# EasyEDA Pro project ProProject_Mini-Cube_2024-04-10.epro, board PCB1
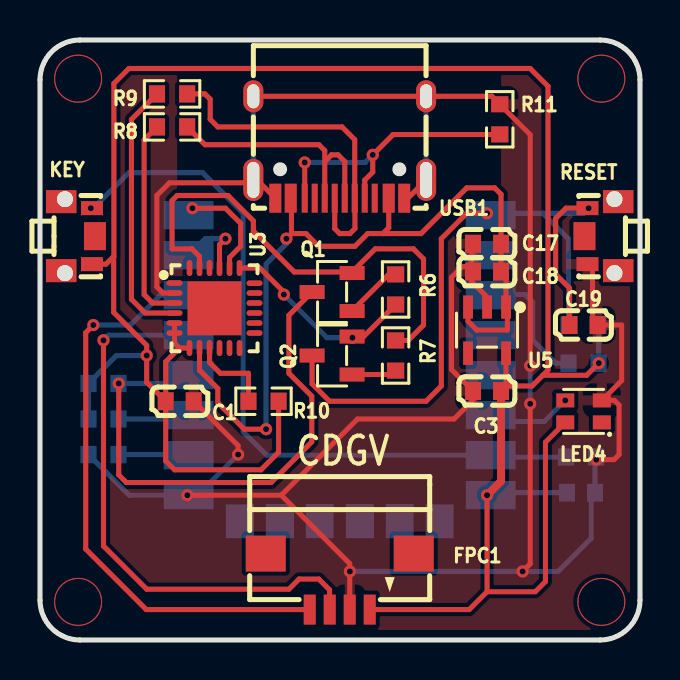
[diagram p5: board, top side]
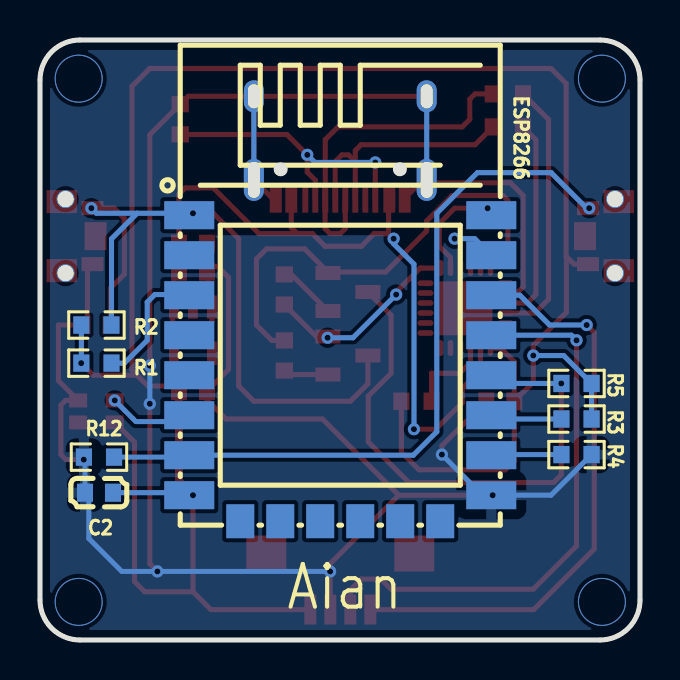
[diagram p6: board, bottom side, seen from below]

Outline 30 x 30 mm; copper layers: Top Layer, Bottom Layer. Coordinates in mm from the lower left corner of the outline.
Outline path: 0,28 0,2 arc(0.59,0.59) 2,0 28,0 arc(29.41,0.59) 30,2 30,28 arc(29.41,29.41) 28,30 2,30 arc(0.59,29.41) 0,28
Stack: Top Layer 0.035mm / Dielectric1 1.51mm FR4 er 4.5 / Bottom Layer 0.035mm

## Design rules (mm)
template: JLCPCB Capability(Two Layers Board)
spacing copperThickness1oz (default): track to track 0.102, other pairs 0.152 to 0.3
spacing copperThickness2oz: track to track 0.203, other pairs 0.152 to 0.3
track width copperThickness1oz (default): min 0.127, default 0.254, max 2.54
track width copperThickness2oz: min 0.203, default 0.254, max 2.54
differential pair differentialPair (default): width min 0.127, default 0.254, max 2.54; gap min 0.152, default 0.152
via viaSize (default): diameter min 0.5, default 0.61, max 10; hole min 0.3, default 0.305, max 6.3

## Placement (name value [footprint] x y rotation side)
C1  100nF  [C0603]  6.98 11.94 180 top
C2  100nF  [C0603]  27.05 7.37 180 bottom
C3  100nF  [C0603]  22.35 12.45 0 top
C17  100nF  [C0603]  22.35 19.81 0 top
C18  1UF  [C0603]  22.35 18.42 0 top
C19  100nF  [C0603]  27.18 15.75 0 top
ESP8266  2.4GHz  [WIFIM-SMD_ESP-12F-ESP8266MOD]  14.99 13.59 270 bottom
FPC1  FPC-4P-1MM  [FFC-SMD_FFC10032-04SBB123W5M]  14.99 2.92 180 top
KEY  GT-TC173C-H029-L1  [SW-SMD_GT-TC173A-H029-L1]  1.91 20.19 270 top
LED4  WS2812B-2020  [LED-SMD_4P-L2.0-W2.0-TL_WS2812B-2020]  27.18 11.43 180 top
Q1  SS8050  [SOT-23-3_L2.9-W1.3-P1.90-LS2.4-BR]  14.6 17.4 0 top
Q2  SS8050  [SOT-23-3_L2.9-W1.3-P1.90-LS2.4-BR]  14.6 14.22 0 top
R1  10K  [R0603]  27.18 13.84 180 bottom
R2  10K  [R0603]  27.18 15.75 180 bottom
R3  10K  [R0603]  3.17 11.05 0 bottom
R4  10K  [R0603]  3.17 9.27 0 bottom
R5  10K  [R0603]  3.17 12.83 180 bottom
R6  1k  [R0603]  17.78 17.53 90 top
R7  1k  [R0603]  17.78 14.22 270 top
R8  220  [R0603]  6.6 25.65 180 top
R9  220  [R0603]  6.6 27.31 180 top
R10  4.7K  [R0603]  11.18 11.94 180 top
R11  5.1K  [R0603]  22.99 26.04 270 top
R12  10K  [R0603]  27.05 9.14 180 bottom
RESET  GT-TC173C-H029-L1  [SW-SMD_GT-TC173A-H029-L1]  28.07 20.19 90 top
U3  CP2104  [QFN-24_L4.0-W4.0-P0.50-BL-EP2.7]  8.73 16.6 270 top
U5  TPRT9013-33GB  [SOT-23-5_L3.0-W1.7-P0.95-LS2.8-BL]  22.35 15.49 180 top
USB1  TYPEC-304-BCP16  [USB-C-SMD_TYPEC-304-BCP16]  14.99 24.64 180 top

## Footprints (pads in the part's own frame, mm; a bottom-side part is the same pattern mirrored in y, then rotated)
C0603
  rect 0.8x0.9 smd: 1(-0.7,0) 2(0.7,0)
FFC-SMD_FFC10032-04SBB123W5M
  rect 0.6x1.5 smd: 1(-1.5,1.4) 2(-0.5,1.4) 3(0.5,1.4) 4(1.5,1.4)
  rect 2x1.8 smd: 5(3.7,-1.4) 6(-3.7,-1.4)
LED-SMD_4P-L2.0-W2.0-TL_WS2812B-2020
  rect 0.9x0.7 smd: 1(-0.915,0.55) 2(-0.915,-0.55) 3(0.915,-0.55) 4(0.915,0.55)
QFN-24_L4.0-W4.0-P0.50-BL-EP2.7
  oval 0.28x0.8 smd: 1(-1.25,-2) 2(-0.75,-2) 3(-0.25,-2) 4(0.25,-2) 5(0.75,-2) 6(1.25,-2) 13(1.25,2) 14(0.75,2) 15(0.25,2) 16(-0.25,2) 17(-0.75,2) 18(-1.242,2)
  oval 0.8x0.28 smd: 7(2,-1.25) 8(2,-0.75) 9(2,-0.25) 10(2,0.25) 11(2,0.75) 12(2,1.25) 19(-2,1.25) 20(-2,0.75) 21(-2,0.25) 22(-2,-0.25) 23(-2,-0.75) 24(-2,-1.25)
  rect 2.7x2.7 smd: 25(0.013,0)
R0603
  rect 0.806x0.864 smd: 1(-0.753,0) 2(0.753,0)
SOT-23-3_L2.9-W1.3-P1.90-LS2.4-BR
  rect 1.25x0.7 smd: 1(1,-0.95) 2(1,0.95) 3(-1,0)
SOT-23-5_L3.0-W1.7-P0.95-LS2.8-BL
  rect 0.49x1.157 smd: 1(-0.95,-1.153) 2(0,-1.153) 3(0.95,-1.153)
  rect 0.49x1.175 smd: 4(0.95,1.153) 5(-0.95,1.153)
SW-SMD_GT-TC173A-H029-L1
  rect 0.7x1.1 smd: 1(-1.4,0.694) 2(1.4,0.694)
  rect 1.4x1.1 smd: 3(0,0.844)
  round 0.9 hole 0.8: 4(-1.85,-0.656) 4(1.85,-0.656)
  rect 1.15x1.524 smd: 4(-1.725,-0.844) 4(1.725,-0.844)
USB-C-SMD_TYPEC-304-BCP16
  oval 1x2.1 hole 0.6x1.8: 13(-4.32,1.633) 14(4.32,1.633)
  oval 1x1.6 hole 0.6x1.2: 15(-4.32,-2.547) 16(4.32,-2.547)
  rect 0.6x1.45 smd: A1B12(-3.225,2.547) A4B9(-2.45,2.547) B1A12(3.22,2.547) B4A9(2.45,2.547)
  rect 0.3x1.45 smd: A5(-1.25,2.547) A6(-0.25,2.547) A7(0.25,2.547) A8(1.25,2.547) B5(1.75,2.547) B6(0.75,2.547) B7(-0.75,2.547) B8(-1.75,2.547)
WIFIM-SMD_ESP-12F-ESP8266MOD
  rect 1.4x2.5 smd: 1(-7.651,-7.551) 2(-5.651,-7.551) 3(-3.651,-7.551) 4(-1.651,-7.551) 5(0.349,-7.551) 6(2.349,-7.551) 7(4.349,-7.551) 8(6.349,-7.551) 9(6.349,7.548) 10(4.349,7.55) 11(2.349,7.551) 12(0.349,7.551) 13(-1.651,7.55) 14(-3.651,7.551) 15(-5.651,7.551) 16(-7.651,7.551)
  rect 1.7x1.4 smd: 17(7.651,-5) 18(7.649,-3.002) 19(7.649,-1.004) 20(7.649,0.998) 21(7.649,2.997) 22(7.651,4.997)

## Nets
+5V: C17.2 C18.2 U3.8 U5.1 U5.3 USB1.A4B9 USB1.B4A9
GND: C1.1 C2.1 C3.1 C17.1 C18.1 C19.2 ESP8266.9 FPC1.2 LED4.2 R4.1 R11.1 R12.1 RESET.1 U3.2 U5.2 USB1.13 USB1.14 USB1.15 USB1.16 USB1.A1B12 USB1.B1A12
VCC: C1.2 C2.2 C3.2 ESP8266.8 FPC1.1 KEY.2 LED4.4 R1.1 R2.1 R3.1 R5.2 R10.1 U3.5 U3.6 U3.7 U5.5
DN: R9.1 USB1.A7 USB1.B7
DP: R8.1 USB1.A6 USB1.B6
DTR: Q1.2 R7.1 U3.23
ESP_RST: C19.1 ESP8266.1 Q2.3 R2.2 RESET.2
ESP_RX: ESP8266.15 U3.21
ESP_TX: ESP8266.16 U3.20
GPIO0: ESP8266.12 Q1.3 R5.1
KEY: ESP8266.7 KEY.1 R12.2
RTS: Q2.2 R6.1 U3.19
SCL: ESP8266.14 FPC1.4
SDA: ESP8266.13 FPC1.3
WS2812B: ESP8266.6 LED4.3
$1N382: ESP8266.10 R4.2
$1N385: ESP8266.11 R3.2
$1N388: ESP8266.3 R1.2
$1N764: Q2.1 R7.2
$1N765: Q1.1 R6.2
$1N803: R8.2 U3.3
$1N809: R9.2 U3.4
$1N935: R10.2 U3.9
$1N1200: R11.2 USB1.A5 USB1.B5

Pads without a net: ESP8266 2 4 5 17 18 19 20 21 22; FPC1 5 6; KEY 3 4; LED4 1; RESET 3 4; U3 1 10 11 12 13 14 15 16 17 18 22 24 25; U5 4; USB1 A8 B8

## Via types
v1: diameter 2.4, hole 2.3, Top Layer to Bottom Layer, 4 vias
v2: diameter 0.61, hole 0.305, Top Layer to Bottom Layer, 25 vias

## Routing (per net, layer and track width the routed paths; a pad name or vN(x,y) marks a point on that pad's centre or on a via; arc(x,y) is an arc through that point)
+5V: length 41.9
  Top Layer w0.254: USB1.B4A9 12.57,22.05 12.57,20.32 ; USB1.A4B9 17.44,20.61 17.14,20.32 ; 17.14,20.32 19.05,20.32 21.34,22.61 22.73,22.61 23.05,22.29 C17.2 C18.2 23.3,18.17 U5.1 23.37,16.58 23.37,15.49 21.84,15.49 21.4,15.94 U5.3 ; 17.14,20.32 16.38,20.32 15.75,19.69 13.93,19.69 13.3,20.32 12.57,20.32 ; 12.57,20.32 v2(12.32,20.07) ; U3.8 7.98,13.49 8.89,12.57 8.89,11.86 10.21,10.54 v2(11.3,10.54)
  Bottom Layer w0.254: v2(12.32,20.07) 12.32,19.81 11.3,18.8 v2(11.3,10.54)
GND: length 136.6
  Top Layer w0.25: R11.1 24.51,25.26 v2(24.51,13.72) ; 7.69,11.94 9.91,9.72 v2(9.91,9.27) ; USB1.16 USB1.15 ; v2(27.81,9.02) 28.7,9.02 28.96,9.27 28.96,11.74 28.72,11.98 LED4.2 29.08,12.97 29.08,15.75 C19.2 ; v2(24.51,11.81) 24.51,3.81
  Top Layer w0.254: v2(15.49,3.43) 15.49,3.44 ; 15.49,3.44 FPC1.2 ; 15.49,3.44 15.49,3.82 12.06,7.24 ; 10.85,23.01 USB1.14 ; 10.85,23.01 10.71,22.86 6.48,22.86 5.84,22.23 5.84,17.66 6.15,17.35 U3.2 ; 10.85,23.01 USB1.B1A12 ; USB1.13 18.39,22.09 USB1.A1B12 ; 12.06,7.24 v2(7.37,7.24) ; 12.06,7.24 15.88,11.05 20.7,11.05 21.65,12 C3.1 20.57,13.52 20.57,18.13 21.11,18.67 21.57,18.67 21.59,18.65 ; USB1.15 22.59,27.19 R11.1 ; 24.51,3.81 v2(24.13,3.43) ; 27.63,18.79 27.63,16 C19.2 ; C17.1 21.59,19.75 21.59,18.65 ; 21.59,18.65 21.59,17.91 22.35,17.15 U5.2
  Bottom Layer w0.25: 27.75,9.09 R12.1 ; 27.75,9.09 C2.1 27.56,7.17 27.56,5.08 25.91,3.43 v2(24.13,3.43) ; 27.75,9.09 27.81,9.03 v2(27.81,9.02) ; ESP8266.9 7.87,7.24 v2(9.91,9.27) ; v2(24.51,13.72) v2(24.51,11.81)
  Bottom Layer w0.254: USB1.14 USB1.16 ; ESP8266.9 4.45,7.24 R4.1 ; USB1.15 USB1.13 ; v2(24.13,3.43) v2(15.49,3.43)
VCC: length 118.2
  Top Layer w0.25: 26.26,10.88 25.27,9.89 25.27,2.92 24.76,2.41 22.35,2.41
  Top Layer w0.254: 3.68,19.18 3.7,19.19 3.7,27.83 4.44,28.58 24.51,28.58 25.4,27.69 25.4,13.5 25.14,13.24 ; 3.68,19.18 3.68,16.38 5.33,14.73 v2(5.33,14.22) 5.33,12.89 C1.2 ; 3.68,19.18 3.3,18.79 2.47,18.79 ; R10.1 11.93,9.39 11.05,8.51 6.73,8.51 6.28,8.95 C1.2 ; v2(22.35,7.24) 22.35,2.41 21.46,1.52 FPC1.1 ; 6.97,14.6 U3.7 ; 6.97,14.6 6.73,14.84 U3.6 U3.5 ; 6.97,14.6 6.28,13.92 C1.2 ; v2(27.94,13.84) 27.33,13.24 25.14,13.24 ; U5.5 23.3,12.7 ; 23.3,12.7 C3.2 ; 23.3,12.7 23.31,12.7 24.6,12.7 25.14,13.24
  Top Layer w0.4: v2(22.35,7.24) 23.05,7.94 C3.2
  Bottom Layer w0.254: C2.2 22.66,7.37 ESP8266.8 22.35,7.24 ; R3.1 R5.2 3.82,14.22 v2(5.33,14.22) ; R2.1 R1.1 v2(27.94,13.84)
(no net):
  vias: v1(1.91,28.07) v1(1.91,1.91) v1(28.07,28.07) v1(28.07,1.91)
DN: length 17.1
  Top Layer w0.254: R9.1 8.25,27.31 8.51,27.04 8.51,26.04 8.89,25.65 15.1,25.65 15.74,25.02 USB1.B7 15.75,22.08 15.75,20.57 15.49,20.32 14.99,20.32 14.74,20.57 USB1.A7
DP: length 12.9
  Top Layer w0.254: USB1.B6 14.24,23.92 ; 14.24,23.92 14.24,24.47 13.94,24.77 8.25,24.77 R8.1 ; 14.24,23.92 14.58,24.26 14.9,24.26 15.24,23.92 15.24,22.09 USB1.A6
DTR: length 24.8
  Top Layer w0.254: R7.1 18.41,14.98 19.18,15.75 19.18,19.05 18.67,19.56 16.76,19.56 15.6,18.4 ; 15.6,18.4 Q1.2 ; 15.6,18.4 12.72,18.4 10.67,20.45 10.67,20.95 9.4,22.23 6.86,22.23 6.6,21.97 6.6,19.56 7.59,19.56 7.98,19.18 U3.23
ESP_RST: length 37.8
  Top Layer w0.254: Q2.3 13.6,12.81 14.48,11.94 19.3,11.94 20.07,12.7 20.07,20.07 21.34,21.34 v2(22.35,21.34) ; v2(27.43,21.59) 27.44,21.59 ; 27.44,21.59 27.63,21.59 ; 27.44,21.59 26.3,21.59 25.78,21.08 25.78,18.29 26.48,17.59 C19.1
  Bottom Layer w0.254: 25.15,21.34 27.18,21.34 v2(27.43,21.59) ; 25.15,21.34 26.42,20.06 R2.2 ; 25.15,21.34 22.44,21.34 ; 22.44,21.34 ESP8266.1 ; 22.44,21.34 v2(22.35,21.34)
ESP_RX: length 3.8
  Top Layer w0.254: v2(9.27,20.07) 8.98,19.77 U3.21
  Bottom Layer w0.254: ESP8266.15 8.26,20.07 v2(9.27,20.07)
ESP_TX: length 5.6
  Top Layer w0.254: U3.20 9.48,19.13 10.03,19.69 10.03,20.83 9.27,21.59 v2(7.62,21.59)
  Bottom Layer w0.254: v2(7.62,21.59) 7.62,21.42 ESP8266.16
GPIO0: length 27.3
  Top Layer w0.254: Q1.3 12.45,16.24 12.45,13.34 13.59,12.19 13.59,9.91 11.56,7.87 4.32,7.87 3.94,8.26 v2(3.94,12.83)
  Bottom Layer w0.254: ESP8266.12 7.02,12.83 v2(3.94,12.83) R5.1
KEY: length 36.9
  Top Layer w0.254: v2(2.54,21.59) 2.47,21.59 2.47,21.59
  Bottom Layer w0.25: ESP8266.7 22.63,9.14 R12.2
  Bottom Layer w0.254: ESP8266.7 11.33,9.24 10.16,10.41 10.16,21.34 8.13,23.37 4.44,23.37 2.67,21.59 v2(2.54,21.59)
RTS: length 10.1
  Top Layer w0.254: R6.1 16.18,15.17 Q2.2 15.62,15.16 v2(15.62,15.11) ; U3.19 10.99,18.6 12.19,17.4 v2(12.19,17.27)
  Bottom Layer w0.254: v2(12.19,17.27) 14.35,15.11 v2(15.62,15.11)
SCL: length 29.2
  Top Layer w0.254: v2(2.67,15.75) 2.29,15.37 2.29,4.55 5.31,1.52 FPC1.4
  Bottom Layer w0.254: v2(2.67,15.75) 4.52,15.75 6.01,17.24 ESP8266.14
SDA: length 28.3
  Top Layer w0.254: FPC1.3 14.48,1.53 14.48,2.51 13.94,3.05 12.95,3.05 12.45,2.54 5.33,2.54 3.17,4.7 v2(3.17,14.99)
  Bottom Layer w0.254: ESP8266.13 3.43,15.24 v2(3.17,14.99)
WS2812B: length 4.3
  Bottom Layer w0.25: v2(26.26,11.98) 25.2,10.92 22.85,10.92 ESP8266.6
$1N382: length 3.5
  Bottom Layer w0.254: ESP8266.10 7.4,9.27 R4.2
$1N385: length 3.6
  Bottom Layer w0.254: R3.2 7.24,11.05 ESP8266.11
$1N388: length 6.4
  Bottom Layer w0.254: R1.2 25.78,13.84 24.64,14.99 24.64,16.89 24.26,17.27 22.57,17.27 ESP8266.3
$1N764: length 2.3
  Top Layer w0.254: R7.2 17.58,13.27 Q2.1
$1N765: length 2.9
  Top Layer w0.254: R6.2 17.44,18.28 Q1.1
$1N803: length 10.3
  Top Layer w0.254: U3.3 5.63,16.85 5.21,17.27 5.21,25.01 R8.2
$1N809: length 13.2
  Top Layer w0.254: U3.4 5.26,16.35 4.57,17.04 4.57,26.03 R9.2
$1N935: length 4.3
  Top Layer w0.254: R10.2 10.42,13.34 9.02,13.34 8.48,13.88 U3.9
$1N1200: length 14.5
  Top Layer w0.254: USB1.B5 v2(13.24,23.88) ; USB1.A5 16.24,22.99 16.64,23.4 v2(16.64,24.26) 17.65,25.27 22.98,25.27 R11.2
  Bottom Layer w0.254: v2(13.24,23.88) 16.26,23.88 v2(16.64,24.26)

## Copper pours and planes (outline as drawn; the poured copper is in the pictures)
GND on Top Layer: -6.1,35.31 3.3,35.31 6.86,31.75 6.86,20.24 22.93,20.24 23.05,20.37 23.05,33.85 23.88,34.67 40.26,34.67 44.07,30.86 44.07,-2.03 40.51,-5.59 -4.83,-5.59 -4.95,-5.71 -6.1,-4.57
GND on Bottom Layer: -6.1,35.31 3.3,35.31 6.86,31.75 6.86,20.24 22.93,20.24 23.05,20.37 23.05,33.85 23.88,34.67 40.26,34.67 44.07,30.86 44.07,-2.03 40.51,-5.59 -4.83,-5.59 -4.95,-5.71 -6.1,-4.57

## Text on the board
Bottom Silkscreen Layer: Aian
Top Silkscreen Layer: CDGV
